# Altium schematic sheet Filter.SchDoc: Title
size A3; CheckedBy: -; CompanyName: CERN; DrawnBy: DrawnBy; Organization: CERN; Address1: European Organization for Nuclear Research; Address2: CH-1211 Genève 23 - Switzerland; Revision: -; SheetNumber: -; SheetTotal: -; EDA_Number: EDA-XXXXX-VX-X; Projet: -; ModifiedBy: -; CreateDate: XX/XX/XXXX; CheckedDate: -; Title2: Title2; DivGrp: TE/MPE; Designer: Designer; ModifiedDate: -
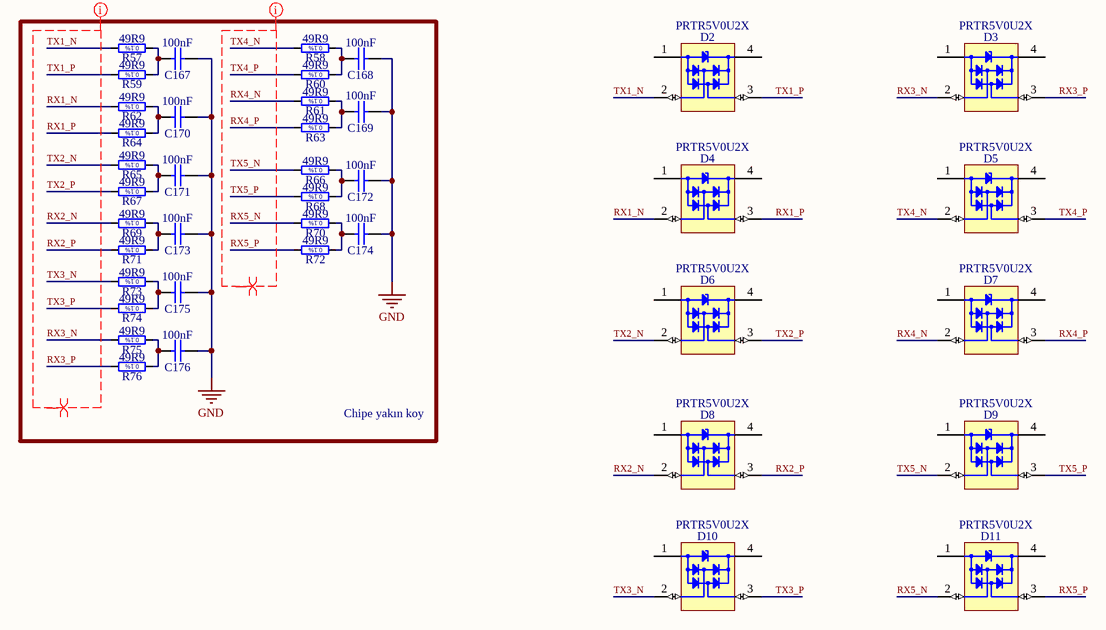
[diagram p0: Filter.SchDoc]

## Parts
C167  100nF  [CAPC1608X87N]
C168  100nF  [CAPC1608X87N]
C169  100nF  [CAPC1608X87N]
C170  100nF  [CAPC1608X87N]
C171  100nF  [CAPC1608X87N]
C172  100nF  [CAPC1608X87N]
C173  100nF  [CAPC1608X87N]
C174  100nF  [CAPC1608X87N]
C175  100nF  [CAPC1608X87N]
C176  100nF  [CAPC1608X87N]
D2  PRTR5V0U2X  [SOT190P230X110-4N]
D3  PRTR5V0U2X  [SOT190P230X110-4N]
D4  PRTR5V0U2X  [SOT190P230X110-4N]
D5  PRTR5V0U2X  [SOT190P230X110-4N]
D6  PRTR5V0U2X  [SOT190P230X110-4N]
D7  PRTR5V0U2X  [SOT190P230X110-4N]
D8  PRTR5V0U2X  [SOT190P230X110-4N]
D9  PRTR5V0U2X  [SOT190P230X110-4N]
D10  PRTR5V0U2X  [SOT190P230X110-4N]
D11  PRTR5V0U2X  [SOT190P230X110-4N]
R57  49R9  [RESC1608X55N]
R58  49R9  [RESC1608X55N]
R59  49R9  [RESC1608X55N]
R60  49R9  [RESC1608X55N]
R61  49R9  [RESC1608X55N]
R62  49R9  [RESC1608X55N]
R63  49R9  [RESC1608X55N]
R64  49R9  [RESC1608X55N]
R65  49R9  [RESC1608X55N]
R66  49R9  [RESC1608X55N]
R67  49R9  [RESC1608X55N]
R68  49R9  [RESC1608X55N]
R69  49R9  [RESC1608X55N]
R70  49R9  [RESC1608X55N]
R71  49R9  [RESC1608X55N]
R72  49R9  [RESC1608X55N]
R73  49R9  [RESC1608X55N]
R74  49R9  [RESC1608X55N]
R75  49R9  [RESC1608X55N]
R76  49R9  [RESC1608X55N]

## Blocks framed on the sheet
Chipe yakın koy: C167-C176 R57-R76

## Nets
GND: C167.1 C168.1 C169.1 C170.1 C171.1 C172.1 C173.1 C174.1 C175.1 C176.1
RX1_N: D4.2(I/O1) R62.2
RX1_P: D4.3(I/O2) R64.2
RX2_N: D8.2(I/O1) R69.2
RX2_P: D8.3(I/O2) R71.2
RX3_N: D3.2(I/O1) R75.2
RX3_P: D3.3(I/O2) R76.2
RX4_N: D7.2(I/O1) R61.2
RX4_P: D7.3(I/O2) R63.2
RX5_N: D11.2(I/O1) R70.2
RX5_P: D11.3(I/O2) R72.2
TX1_N: D2.2(I/O1) R57.2
TX1_P: D2.3(I/O2) R59.2
TX2_N: D6.2(I/O1) R65.2
TX2_P: D6.3(I/O2) R67.2
TX3_N: D10.2(I/O1) R73.2
TX3_P: D10.3(I/O2) R74.2
TX4_N: D5.2(I/O1) R58.2
TX4_P: D5.3(I/O2) R60.2
TX5_N: D9.2(I/O1) R66.2
TX5_P: D9.3(I/O2) R68.2
NetC167_2: C167.2 R57.1 R59.1
NetC168_2: C168.2 R58.1 R60.1
NetC169_2: C169.2 R61.1 R63.1
NetC170_2: C170.2 R62.1 R64.1
NetC171_2: C171.2 R65.1 R67.1
NetC172_2: C172.2 R66.1 R68.1
NetC173_2: C173.2 R69.1 R71.1
NetC174_2: C174.2 R70.1 R72.1
NetC175_2: C175.2 R73.1 R74.1
NetC176_2: C176.2 R75.1 R76.1

Not connected (* = marked no-connect by the designer): D2 1(GND) 4(VCC); D3 1(GND) 4(VCC); D4 1(GND) 4(VCC); D5 1(GND) 4(VCC); D6 1(GND) 4(VCC); D7 1(GND) 4(VCC); D8 1(GND) 4(VCC); D9 1(GND) 4(VCC); D10 1(GND) 4(VCC); D11 1(GND) 4(VCC)

## Layout directives
differential pair: RX1_N, RX1_P, RX2_N, RX2_P, RX3_N, RX3_P, RX4_N, RX4_P, RX5_N, RX5_P, TX1_N, TX1_P, TX2_N, TX2_P, TX3_N, TX3_P, TX4_N, TX4_P, TX5_N, TX5_P
net class Ethernet: RX1_N, RX1_P, RX2_N, RX2_P, RX3_N, RX3_P, RX4_N, RX4_P, RX5_N, RX5_P, TX1_N, TX1_P, TX2_N, TX2_P, TX3_N, TX3_P, TX4_N, TX4_P, TX5_N, TX5_P

## Notes on the sheet
- Title
- Size:
- Date:
- A3
- Number:
- Time:
- Revision:
- Sheet
- of
- File:
- (in symbol R0603_49R9_0.1%_0.063W_10PPM) 0.1%

## Library data of the parts
C167-C176 = CC0603_100NF_50V_10%_X7R: Non-polarised capacitor; Part Description: SMD Multilayer Chip Ceramic Capacitor; Manufacturer: MULTICOMP; Manufacturer Part Number: MCB0603R104KCT; Manufacturer1 Part Number: 223858615649; Voltage: 50V; TC: X7R; Tolerance: ±10%; Table: Capacitors SMD; Voltage Rating: 16; Capacitance Tolerance ±: ± 10%; Dielectric Characteristic: X7; Capacitance: 0.1; Description: MULTICOMP - MCB0603R104KCT - CAP, MLCC, X7R, 100NF, 16V, 0603; SVHC: No SVHC (17-Dec-2015); Capacitor Terminals: SMD; Ceramic Capacitor Case: 0603 [1608 Metric]; Product Range: MCB Series; Part Number: CC0603_100NF_50V_10%_X7R; Component Kind: Standard; Component Type: Standard; Pin Count: 2; Value: 100nF; Status: Preferred; Case: 0603; Mounted: Yes; Socket: No; SMD: Yes; Manufacturer1 Example: PHYCOMP; Manufacturer1 ComponentHeight: 0.87mm; HelpURL: \\cern.ch\dfs\Applications\Altium\Datasheets\CC0603_X7R_PHYCOMP.pdf; Author: CERN DEM JLC; CreateDate: 03.12.2007; LatestRevisionDate: 03.12.2007; Supplier: Farnell; Capacitance Tolerance: ± 10%; Supplier Part Number: 9406140; RoHS: YES; Packaging: Cut Tape; MSL: -; Operating Temperature Max: 125; Operating Temperature Range: -55°C to +125°C<!--FANDB--><div class="features-and-benefits-container"><div class="features-and-benefits-description"><span class="features-benefits-value">The MCB0603R104KCT is a multilayer Ceramic Capacitor with 0603 chip, for general digital circuit. Consists of a conducting material and electrodes. To manufacture a chip-type SMT and achieve miniaturization, high density and high efficiency, ceramic condensers are used. MLCC is made by X7; Operating Temperature Min: -55
D2-D11 = PRTR5V0U2X: Ultra Low Capacitance Double Rail-to-Rail ESD Protection Diode; Part Description: Ultra Low Capacitance (1pF) Double Rail-to-Rail ESD Protection Diode (8kV); Manufacturer: NXP Semiconductors; Manufacturer Part Number: PRTR5V0U2X,215; Voltage: 5.5V; Table: Diodes; Voltage - Reverse Standoff (Typ): 5.5V (Max); Capacitance @ Frequency: 1pF @ 1MHz; Type: Steering (Rail to Rail); Power Line Protection: Yes; Voltage - Breakdown (Min): 6V; Bidirectional Channels: 2; Part Number: PRTR5V0U2X; Component Kind: Standard; Component Type: Standard; Device: PRTR5V0U2X; PackageDescription: SOT143B, SOT, 1.90mm Pitch; 4 Pin, 1.30mm W X 2.90mm L X 1.10mm H body, IPC Medium Density; Pin Count: 4; Case: SOT143B; Mounted: Yes; Socket: No; SMD: Yes; ComponentHeight: 1.1mm; HelpURL: \\cern.ch\dfs\Applications\Altium\Datasheets\PRTR5V0U2X.pdf; Author: CERN DEM JLC; CreateDate: 22.03.2011; LatestRevisionDate: 22.03.2011; Applications: General Purpose; Packaging: Cut Tape (CT); Voltage - Clamping (Max) @ Ipp: -; Operating Temperature: -40°C ~ 85°C (TA); Category: Circuit Protection; Package / Case: TO-253-4, TO-253AA; Supplier: Digi-Key; Supplier Device Package: SOT-143B; Mounting Type: Surface Mount; Power - Peak Pulse: -; Unidirectional Channels: -; RoHS: RoHS Compliant; Supplier Part Number: 568-4140-1-ND; Current - Peak Pulse (10/1000µs): -
R57-R76 = R0603_49R9_0.1%_0.063W_10PPM: Resistor - 0.1%; Part Description: Thin Film Chip Resistor; Manufacturer: Panasonic Electronic Components; Manufacturer Part Number: ERJ-3EKF49R9V; Manufacturer1 Part Number: RN73C1J49R9BTDF; Power: 0.063W; TC: ±10ppm; Tolerance: ±1%; Table: Resistors SMD; Description: RES SMD 49.9 OHM 1% 1/10W 0603; Resistance (Ohms): 49.9; Temperature Coefficient: ±100ppm/°C; Power (Watts): 0.1W, 1/10W; Part Number: R0603_49R9_0.1%_0.063W_10PPM; Component Kind: Standard; Component Type: Standard; Pin Count: 2; Value: 49R9; Status: Not recommended; Case: 0603; Mounted: Yes; Socket: No; SMD: Yes; Manufacturer1 Example: TYCO HOLSWORTHY; Manufacturer1 ComponentHeight: 0.5mm; HelpURL: \\cern.ch\dfs\Applications\Altium\Datasheets\R0603_Tyco_RN73.pdf; Author: CERN DEM JLC; CreateDate: 03.12.2007; LatestRevisionDate: 13.03.2008; Supplier Device Package: 0603; Height: 0.022" (0.55mm); Packaging: Digi-Reel®; Operating Temperature: -55°C ~ 155°C; Category: Resistors; Supplier Part Number: P49.9HDKR-ND; Size / Dimension: 0.063" L x 0.031" W (1.60mm x 0.80mm); Package / Case: 0603 (1608 Metric); Supplier: Digi-Key; RoHS: RoHS Compliant; Composition: Thick Film; Number of Terminations: 2; Features: Automotive AEC-Q200